# EAGLE design Launch_Tower_Ignition_Board_v6-3 (EAGLE 6.2)
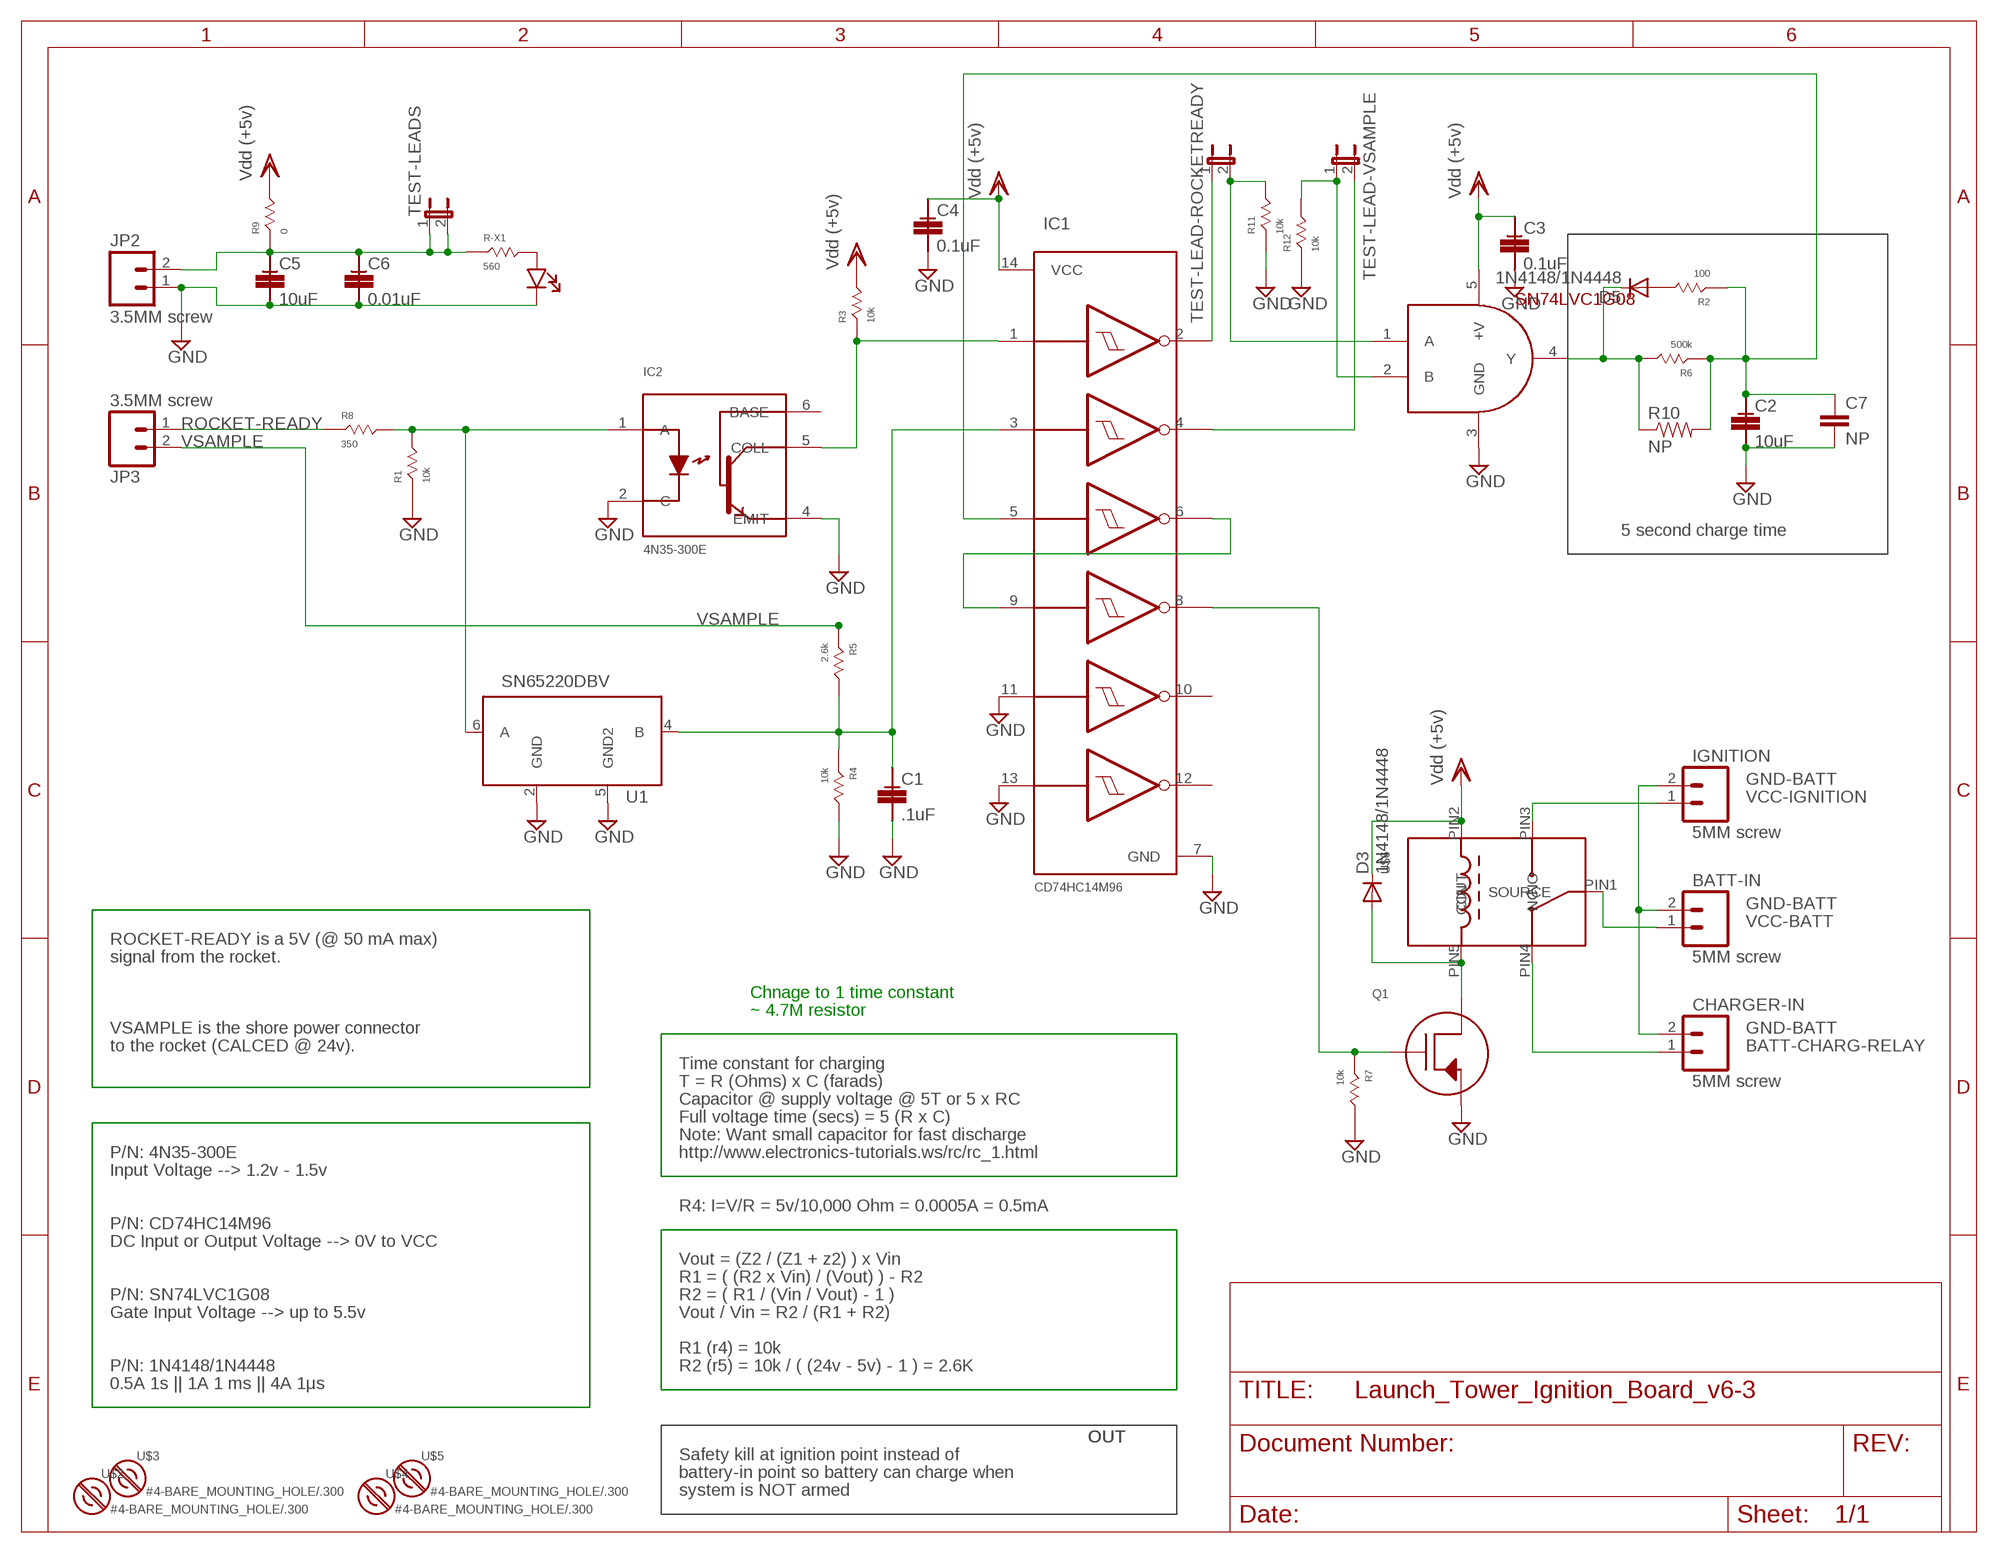
[diagram p0: schematic, sheet 1]

## Parts
BATT-IN  5MM screw  M025MM  [SCREWTERMINAL-5MM-2]
C1  .1uF  CAPACITOR-0805  [0805]
C2  10uF  CAPACITOR-0805  [0805]
C3  0.1uF  CAPACITOR-0805  [0805]
C4  0.1uF  CAPACITOR-0805  [0805]
C5  10uF  CAPACITOR-0805  [0805]
C6  0.01uF  CAPACITOR-0805  [0805]
C7  NP  CAPPTH  [CAP-PTH-SMALL]
CHARGER-IN  5MM screw  M025MM  [SCREWTERMINAL-5MM-2]
D3  1N4148/1N4448  DIODEPTH  [DIODE-1N4001]
D5  1N4148/1N4448  DIODEPTH  [DIODE-1N4001]
IC1  INVERT GATES  HEX_INV_SHMITT_TRIG  [INVERTSOIC14]
IC2  OPTOISOLATOR  [4N35-300E]
IGNITION  5MM screw  M025MM  [SCREWTERMINAL-5MM-2]
JP2  3.5MM screw  M023.5MM  [SCREWTERMINAL-3.5MM-2]
JP3  3.5MM screw  M023.5MM  [SCREWTERMINAL-3.5MM-2]
LED-POWER-INDICATOR  LED-550-XX04  [LED-550]
Q1  NMOSFET  [FETSO-8]
R1  10k  RESISTOR-0805  [0805]
R2  100  RESISTOR-0805  [0805]
R3  10k  RESISTOR-0805  [0805]
R4  10k  RESISTOR-0805  [0805]
R5  2.6k  RESISTOR-0805  [0805]
R6  500k  RESISTOR-0805  [0805]
R7  10k  RESISTOR-0805  [0805]
R8  350  RESISTOR-0805  [0805]
R9  0  RESISTOR-0805  [0805]
R10  NP  RESISTORPTH-1/4W  [AXIAL-0.4]
R11  10k  RESISTOR-0805  [0805]
R12  10k  RESISTOR-0805  [0805]
R-X1  560  RESISTOR-0805  [0805]
TEST-LEAD-ROCKETREADY  JUMPER-2PTH  [1X02]
TEST-LEAD-VSAMPLE  JUMPER-2PTH  [1X02]
TEST-LEADS  JUMPER-2PTH  [1X02]
U1  SN65220DBV  [SOT23-6L]
U$1  AND GATE  SN74LVC1G08  [SOT23-5]
U$2  #4-BARE_MOUNTING_HOLE/.300  [#4/.300-BARE+STD_NUT_OR_STAR_WASHER]
U$3  #4-BARE_MOUNTING_HOLE/.300  [#4/.300-BARE+STD_NUT_OR_STAR_WASHER]
U$4  #4-BARE_MOUNTING_HOLE/.300  [#4/.300-BARE+STD_NUT_OR_STAR_WASHER]
U$5  #4-BARE_MOUNTING_HOLE/.300  [#4/.300-BARE+STD_NUT_OR_STAR_WASHER]
U$6  RELAY-2  [G5LA]

## Nets
BATT-CHARG-RELAY: CHARGER-IN.1 U$6.PIN4(NC)
GND: C1.CATHODE C2.CATHODE C3.CATHODE C4.CATHODE C5.CATHODE C6.CATHODE C7.2 IC1.7(GND) IC1.11(5A) IC1.13(6A) IC2.2(C) IC2.4(EMIT) JP2.1 LED-POWER-INDICATOR.CATHODE Q1.1(SOURCE) R1.ANODE R4.CATHODE R7.CATHODE R11.ANODE R12.ANODE U1.2(GND) U1.5(GND2) U$1.3(GND)
GND-BATT: BATT-IN.2 CHARGER-IN.2 IGNITION.2
N$1: R12.CATHODE TEST-LEAD-VSAMPLE.1 U$1.2(B)
N$2: LED-POWER-INDICATOR.ANODE R-X1.CATHODE
N$3: IC1.1(1A) IC2.5(COLL) R3.ANODE
N$4: JP3.1 R8.ANODE
N$5: R11.CATHODE TEST-LEAD-ROCKETREADY.2 U$1.1(A)
N$6: IC1.4(2Y) TEST-LEAD-VSAMPLE.2
N$7: C1.ANODE IC1.3(2A) R4.ANODE R5.CATHODE U1.4(B)
N$8: D5.A R2.CATHODE
N$9: D3.A Q1.5(DRAIN) U$6.PIN5(CIN)
N$10: IC1.8(4Y) Q1.4(GATE) R7.ANODE
N$11: IC1.2(1Y) TEST-LEAD-ROCKETREADY.1
N$12: C5.ANODE C6.ANODE JP2.2 R9.ANODE R-X1.ANODE TEST-LEADS.1 TEST-LEADS.2
N$13: D5.C R6.CATHODE R10.P$1 U$1.4(Y)
N$15: C2.ANODE C7.1 IC1.5(3A) R2.ANODE R6.ANODE R10.P$2
N-NOT2: IC1.6(3Y) IC1.9(4A)
ROCKET-READY: IC2.1(A) R1.CATHODE R8.CATHODE U1.6(A)
VCC-BATT: BATT-IN.1 U$6.PIN1(SOURCE)
VCC-IGNITION: IGNITION.1 U$6.PIN3(NO)
VDD: C3.ANODE C4.ANODE D3.C IC1.14(VCC) R3.CATHODE R9.CATHODE U$1.5(+V) U$6.PIN2(COUT) ; supply symbol labelled Vdd (+5v)
VSAMPLE: JP3.2 R5.ANODE
Unconnected: IC1.10(5Y) IC1.12(6Y) IC2.6(BASE)

## Notes on the sheet
- 5 second charge time
- ROCKET-READY is a 5V (@ 50 mA max)
- signal from the rocket.
- Chnage to 1 time constant
- ~ 4.7M resistor
- VSAMPLE is the shore power connector
- to the rocket (CALCED @ 24v).
- Time constant for charging
- T = R (Ohms) x C (farads)
- Capacitor @ supply voltage @ 5T or 5 x RC
- Full voltage time (secs) = 5 (R x C)
- Note: Want small capacitor for fast discharge
- P/N: 4N35-300E | http://www.electronics-tutorials.ws/rc/rc_1.html
- Input Voltage --> 1.2v - 1.5v
- R4: I=V/R = 5v/10,000 Ohm = 0.0005A = 0.5mA
- P/N: CD74HC14M96
- DC Input or Output Voltage --> 0V to VCC
- Vout = (Z2 / (Z1 + z2) ) x Vin
- R1 = ( (R2 x Vin) / (Vout) ) - R2
- P/N: SN74LVC1G08 | R2 = ( R1 / (Vin / Vout) - 1 )
- Gate Input Voltage --> up to 5.5v | Vout / Vin = R2 / (R1 + R2)
- R1 (r4) = 10k
- P/N: 1N4148/1N4448 | R2 (r5) = 10k / ( (24v - 5v) - 1 ) = 2.6K
- 0.5A 1s || 1A 1 ms || 4A 1μs
- OUT | OUT | OUT
- Safety kill at ignition point instead of
- battery-in point so battery can charge when
- system is NOT armed

## Library data of the parts
BATT-IN CHARGER-IN IGNITION JP2 JP3 = SparkFun:M02: Header 2 Standard 2-pin 0.1" header. Use with straight break away headers (SKU : PRT-00116), right angle break away headers (PRT-00553), swiss pins (PRT-00743), machine pins (PRT-00117), and female headers (PRT-00115). Molex polarized connector foot print use with SKU : PRT-08233 with associated crimp pins and housings.
C1-C6 = launch-tower:CAPACITOR-0805
C7 = SparkFun:CAP: Capacitor Standard 0603 ceramic capacitor, and 0.1" leaded capacitor.
D3 D5 = SparkFun:DIODE: Diode These are standard reverse protection diodes and small signal diodes. SMA package can handle up to about 1A. SOD-323 can handle about 200mA. What the SOD-323 package when ordering, there are some mfgs out there that are 5-pin packages.
IC1 = launch-tower:HEX_INV_SHMITT_TRIG: Single Schmitt-Trigger Inverter Gate
IC2 = launch-tower:OPTOISOLATOR
LED-POWER-INDICATOR = launch-tower:LED-550-XX04
Q1 = launch-tower:NMOSFET
R1-R9 R11 R12 R-X1 = launch-tower:RESISTOR-0805
R10 = SparkFun:RESISTOR: Resistor Basic schematic elements and footprints for 0603, 1206, and PTH resistors.
TEST-LEAD-ROCKETREADY TEST-LEAD-VSAMPLE TEST-LEADS = SparkFun:JUMPER-2: Jumper Basic 0.1" spaced jumper. Use with breakaway headers.
U1 = sn65220:SN65220
U$1 = SparkFun:SN74LVC1G08
U$2-U$5 = mount:#4-BARE_MOUNTING_HOLE: 1/8" drill hole for #4 screw mount
U$6 = launch-tower:RELAY-2

## Board
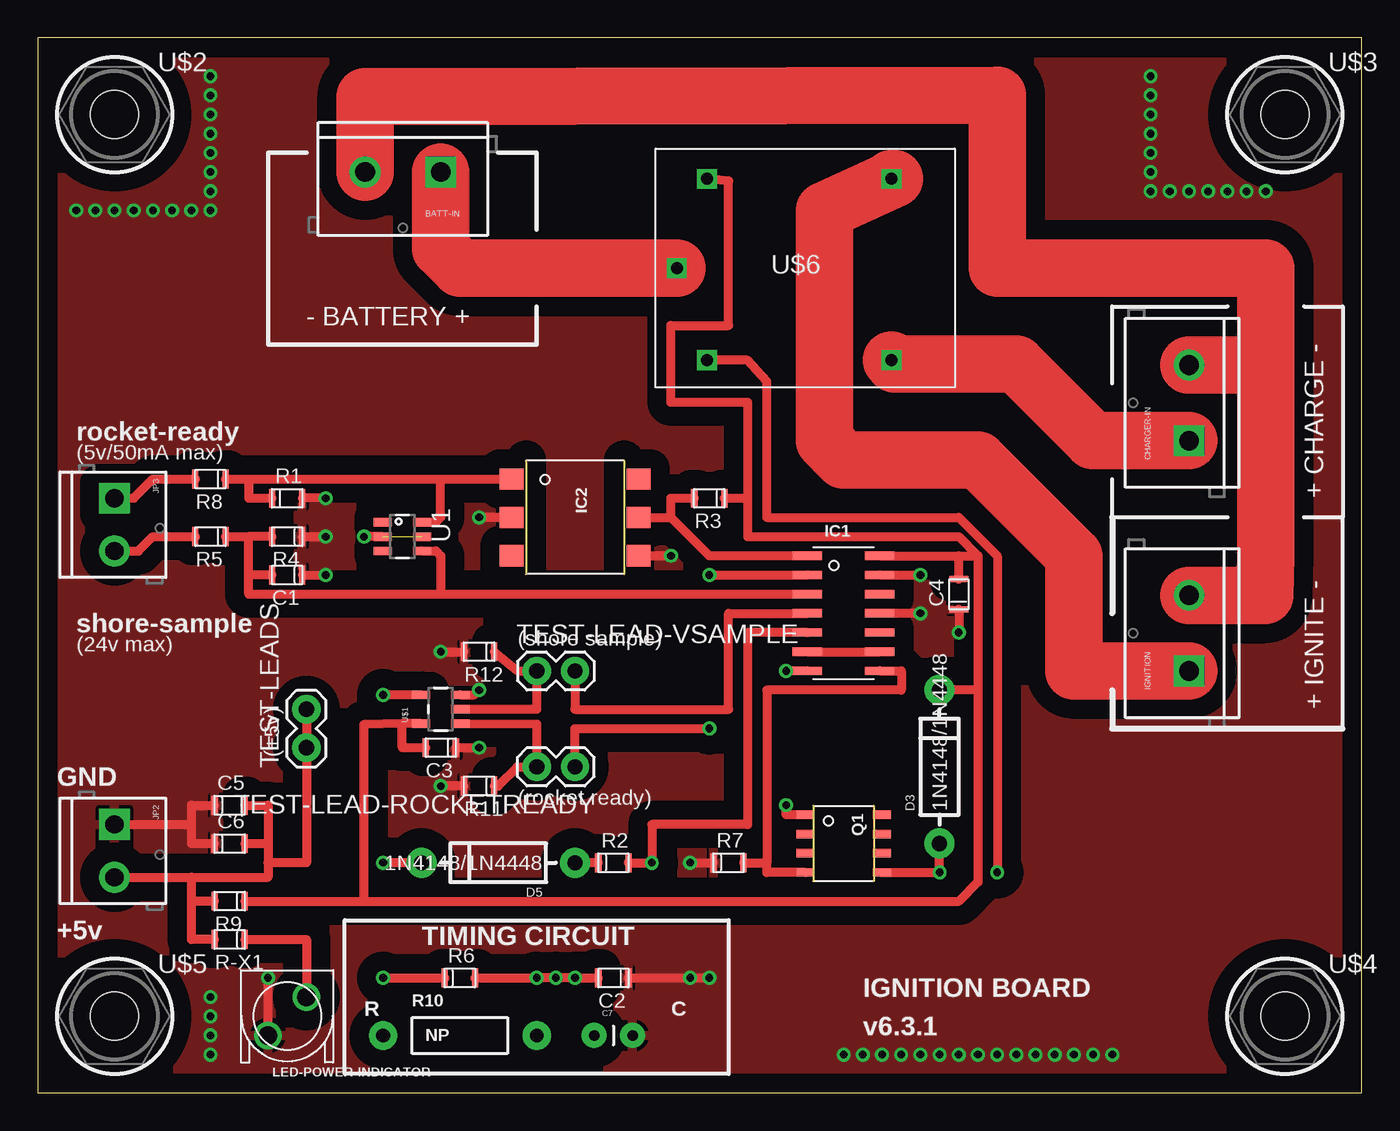
[diagram p1: board, top side]
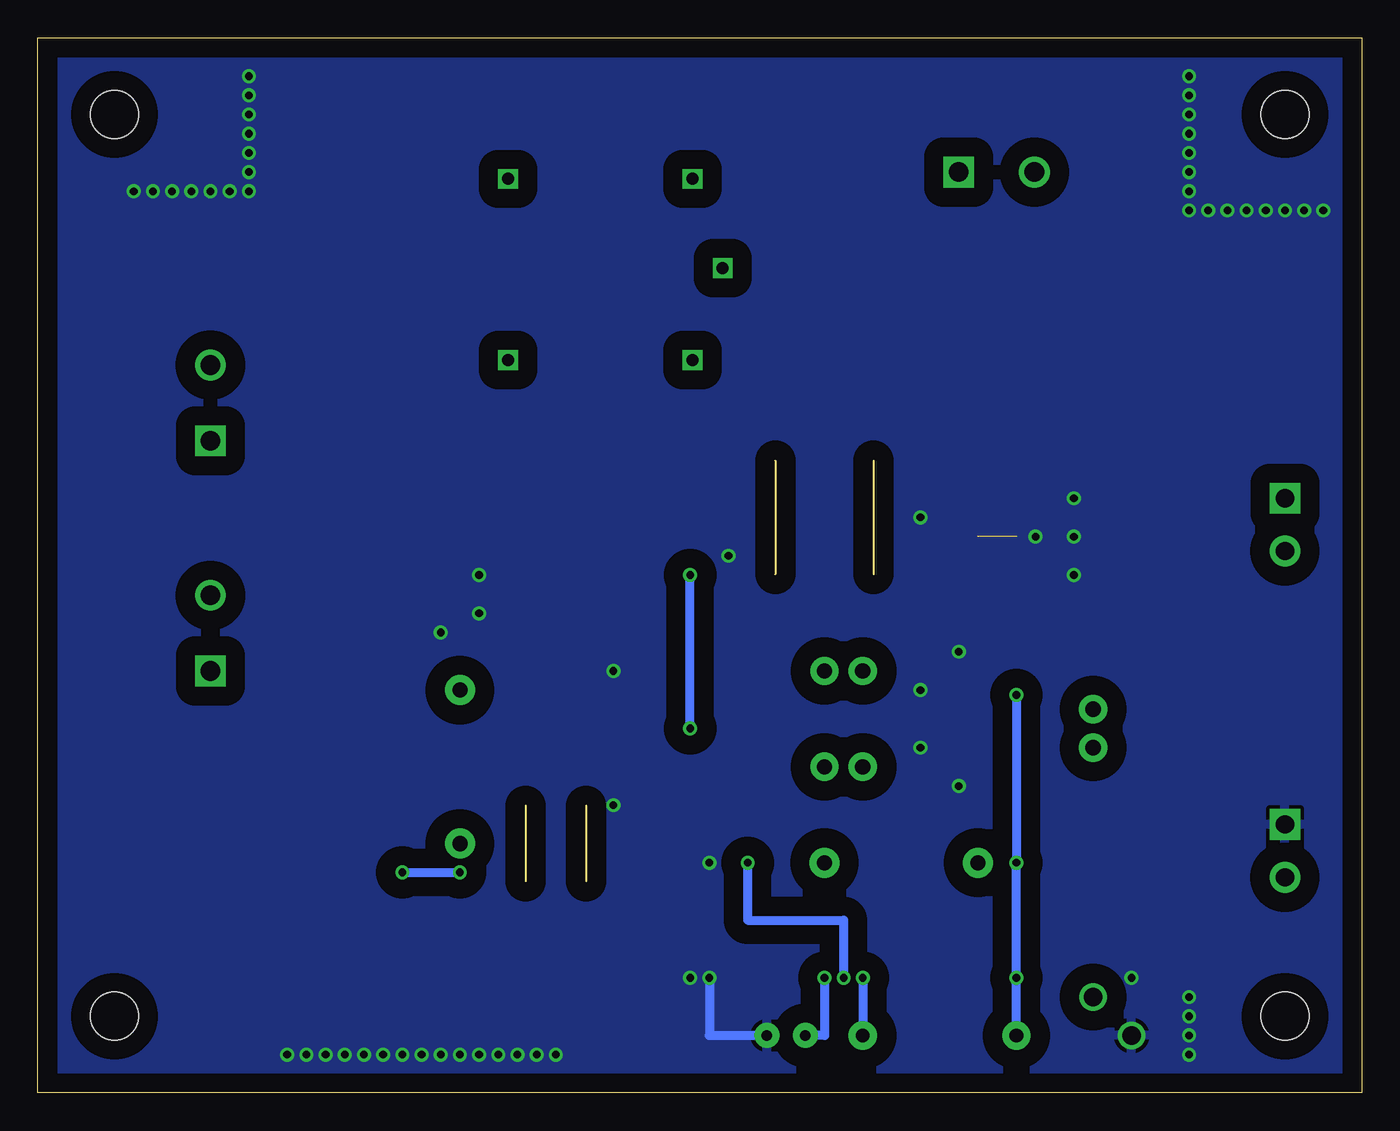
[diagram p2: board, bottom side, seen from below]

Size 87.63 x 69.85 mm. Coordinates in mm from the lower left corner, seen from the top.
Outline: 0,0 87.63,0 87.63,69.85 0,69.85 0,0
Copper layers (1*16): Top 0.035mm / dielectric 1.5mm / Bottom 0.035mm
Design rules: minimum track width 10mil, minimum drill 24mil, track to track 8mil, track to pad 8mil, pad to pad 8mil, via to via 8mil, smd to smd 8mil, copper to edge 40mil, drill to drill 8mil, minimum pad ring 10mil, minimum via ring 8mil, stop-mask expansion 4mil, vias tented up to drill 0mil, thermal gap 10mil

### Footprints (pad centres in the part's own frame; a part is rotated, then mirrored left to right if it is on the bottom)
SCREWTERMINAL-5MM-2 = drill 1.3 pad 2.032 square: 1 0,0 | drill 1.3 pad 2.032: 2 5,0
0805 = smd 0.4 x 1.25: ANODE -1,0; CATHODE 1,0
CAP-PTH-SMALL = drill 0.7 pad 1.651: 1 0,0; 2 2.54,0
DIODE-1N4001 = drill 1 pad 1.981: A -5.08,0; C 5.08,0
INVERTSOIC14 = smd 0.55 x 1.95: 1 -3.81,-2.4; 2 -2.54,-2.4; 3 -1.27,-2.4; 4 0,-2.4; 5 1.27,-2.4; 6 2.54,-2.4; 7 3.81,-2.4; 8 3.81,2.4; 9 2.54,2.4; 10 1.27,2.4; 11 0,2.4; 12 -1.27,2.4; 13 -2.54,2.4; 14 -3.81,2.4
4N35-300E = smd 1.4 x 1.6: 1 -2.54,-4.2; 2 0,-4.2; 3 2.54,-4.2; 4 2.54,4.2; 5 0,4.2; 6 -2.54,4.2
SCREWTERMINAL-3.5MM-2 = drill 1.2 pad 2.032 square: 1 0,0 | drill 1.2 pad 2.032: 2 3.5,0
LED-550 = drill 1.22: ANODE 1.27,1.27; CATHODE -1.27,-1.27
FETSO-8 = smd 0.559 x 1.194: 1 -1.905,-2.527; 2 -0.635,-2.527; 3 0.635,-2.527; 4 1.905,-2.527; 5 1.905,2.527; 6 0.635,2.527; 7 -0.635,2.527; 8 -1.905,2.527
AXIAL-0.4 = drill 0.9 pad 1.88: P$1 -5.08,0; P$2 5.08,0
1X02 = drill 1.016 pad 1.88: 1 0,0; 2 2.54,0
SOT23-6L = smd 0.55 x 1.2: 1 -0.95,-1.3; 2 0,-1.3; 3 0.95,-1.3; 4 0.95,1.3; 5 0,1.3; 6 -0.95,1.3
SOT23-5 = smd 0.55 x 1.2: 1 -0.95,-1.3; 2 0,-1.3; 3 0.95,-1.3; 4 0.95,1.3; 5 -0.95,1.3
#4/.300-BARE+STD_NUT_OR_STAR_WASHER = hole 3.175: 0,0
G5LA = drill 0.8 square: PIN1 -8.5,0; PIN2 -6.5,5.9; PIN3 5.7,5.9; PIN4 5.7,-6.1; PIN5 -6.5,-6.1

### Placement (x,y rotation side)
BATT-IN  26.67,60.96 180 top
C1  16.51,34.29 0 top
C2  38.1,7.62 0 top
C3  26.67,22.86 0 top
C4  60.96,33.02 270 top
C5  12.7,19.05 180 top
C6  12.7,16.51 180 top
C7  36.83,3.81 0 top
CHARGER-IN  76.2,43.18 90 top
D3  59.69,21.59 90 top
D5  30.48,15.24 180 top
IC1  53.34,31.75 270 top
IC2  35.56,38.1 270 top
IGNITION  76.2,27.94 90 top
JP2  5.08,17.78 270 top
JP3  5.08,39.37 270 top
LED-POWER-INDICATOR  16.51,5.08 0 top
Q1  53.34,16.51 270 top
R1  16.51,39.37 180 top
R2  38.1,15.24 180 top
R3  44.45,39.37 0 top
R4  16.51,36.83 0 top
R5  11.43,36.83 0 top
R6  27.94,7.62 180 top
R7  45.72,15.24 180 top
R8  11.43,40.64 0 top
R9  12.7,12.7 0 top
R10  27.94,3.81 0 top
R11  29.21,20.32 0 top
R12  29.21,29.21 0 top
R-X1  12.7,10.16 0 top
TEST-LEAD-ROCKETREADY  35.56,21.59 180 top
TEST-LEAD-VSAMPLE  33.02,27.94 0 top
TEST-LEADS  17.78,22.86 90 top
U1  24.13,36.83 270 top
U$1  26.67,25.4 90 top
U$2  5.08,64.77 0 top
U$3  82.55,64.77 0 top
U$4  82.55,5.08 0 top
U$5  5.08,5.08 0 top
U$6  50.8,54.61 0 top

### Tracks (layer width: path | path; a pad name or v marks a point on that pad's centre or on a via)
BATT-CHARG-RELAY
  Top 3.81: CHARGER-IN.1 69.85,43.18 64.77,48.26 56.75,48.26 U$6.PIN4
GND  (via drill 0.51)  (1 unrouted)
  Top 0.61: IC1.7 v49.53,27.94 | Q1.1 49.53,18.41 v49.53,19.05 | v41.91,35.56 IC2.4 | IC2.2 v29.21,38.1 | U1.2 v21.59,36.83 | U$1.3 28.89,26.35 v29.21,26.67 | v58.42,31.75 IC1.11 | IC1.13 v58.42,34.29 | 10.16,17.78 10.16,19.05 C5.CATHODE | 10.16,17.78 10.16,16.51 C6.CATHODE | JP2.1 10.16,17.78 | LED-POWER-INDICATOR.CATHODE v15.24,7.62 | v19.05,39.37 R1.ANODE | R4.CATHODE v19.05,36.83 | v43.18,15.24 R7.CATHODE | v26.67,29.21 R12.ANODE | R11.ANODE v26.67,20.32 | v44.45,7.62 v43.18,7.62 C2.CATHODE | C3.CATHODE v29.21,22.86 | C4.CATHODE v60.96,30.48 | C1.CATHODE v19.05,34.29
  Bottom 0.61: v43.18,7.62 43.18,3.81 C7.2
  other vias: 69.85,2.54 68.58,2.54 67.31,2.54 66.04,2.54 64.77,2.54 63.5,2.54 62.23,2.54 60.96,2.54 59.69,2.54 58.42,2.54 57.15,2.54 55.88,2.54 54.61,2.54 53.34,2.54 73.66,67.31 73.66,66.04 73.66,64.77 73.66,63.5 73.66,62.23 73.66,60.96 73.66,59.69 74.93,59.69 76.2,59.69 77.47,59.69 78.74,59.69 80.01,59.69 81.28,59.69 11.43,67.31 11.43,66.04 11.43,64.77 11.43,63.5 11.43,62.23 11.43,60.96 11.43,59.69 11.43,58.42 10.16,58.42 8.89,58.42 7.62,58.42 6.35,58.42 5.08,58.42 3.81,58.42 2.54,58.42 11.43,2.54 11.43,3.81 11.43,5.08 11.43,6.35 71.12,2.54
  pour Top (isolate 1.27): 1.27,68.58 86.36,68.58 86.36,1.27 1.27,1.27
  pour Bottom (isolate 1.27): 1.27,68.58 86.36,68.58 86.36,1.27 1.27,1.27
GND-BATT
  Top 3.81: BATT-IN.2 21.67,65.96 63.5,66.04 63.5,54.61 81.28,54.61 81.28,48.26 | 81.28,48.26 81.28,35.56 81.2,32.94 IGNITION.2 | CHARGER-IN.2 81.2,48.18 81.28,48.26
N$1
  Top 0.61: U$1.2 33.02,25.4 TEST-LEAD-VSAMPLE.1 31.75,27.94 R12.CATHODE
N$2
  Top 0.61: R-X1.CATHODE 17.78,10.16 LED-POWER-INDICATOR.ANODE
N$3
  Top 0.61: IC2.5 41.91,38.1 | IC1.1 44.45,35.56 43.18,36.83 41.91,38.1 | 41.91,38.1 41.91,39.37 R3.ANODE
N$4
  Top 0.61: JP3.1 6.35,39.37 7.62,40.64 R8.ANODE
N$5
  Top 0.61: U$1.1 33.02,24.43 33.02,24.42 33.02,22.86 TEST-LEAD-ROCKETREADY.2 31.75,21.59 30.48,20.32 R11.CATHODE
N$6
  Top 0.61: IC1.4 45.72,31.75 45.72,25.4 35.56,25.4 TEST-LEAD-VSAMPLE.2
N$7
  Top 0.61: 13.97,34.29 13.97,33.02 26.67,33.02 | 13.97,34.29 13.97,36.83 | 26.67,33.02 IC1.3 | U1.4 26.35,35.88 26.67,35.56 26.67,33.02 | R5.CATHODE 13.97,36.83 | R4.ANODE 13.97,36.83 | C1.ANODE 13.97,34.29
N$8
  Top 0.61: R2.CATHODE D5.A
N$9  (via drill 0.51)
  Top 0.61: Q1.5 v59.69,14.61 D3.A | U$6.PIN5 46.99,48.51 48.26,47.09 48.26,38.1 60.96,38.1 63.5,35.56 v63.5,14.61
  Bottom 0.61: v63.5,14.61 v59.69,14.61
N$10
  Top 0.61: IC1.8 57.15,27.94 57.15,26.67 48.26,26.67 48.26,15.24 | Q1.4 48.26,14.61 48.26,15.24 | R7.ANODE 48.26,15.24
N$11  (via drill 0.51)
  Top 0.61: v44.45,24.13 35.56,24.13 TEST-LEAD-ROCKETREADY.1 | v44.45,34.29 IC1.2
  Bottom 0.61: v44.45,24.13 v44.45,34.29
N$12
  Top 0.61: 15.24,16.51 15.24,19.05 C5.ANODE | 15.24,16.51 15.24,15.24 | JP2.2 10.16,14.28 | 10.16,14.28 15.24,14.28 15.24,15.24 | 10.16,14.28 10.16,12.7 | 10.16,12.7 10.16,10.16 R-X1.ANODE | 15.24,15.24 17.78,15.24 TEST-LEADS.1 TEST-LEADS.2 | R9.ANODE 10.16,12.7 | C6.ANODE 15.24,16.51
N$13  (via drill 0.51)
  Top 0.61: D5.C v22.86,15.24 | U$1.4 v22.86,26.35 | v22.86,7.62 R6.CATHODE
  Bottom 0.61: v22.86,26.35 v22.86,15.24 v22.86,7.62 R10.P$1
N$15  (via drill 0.51)
  Top 0.61: IC1.5 46.99,30.48 46.99,17.78 40.64,17.78 v40.64,15.24 R2.ANODE | R6.ANODE v33.02,7.62 v34.29,7.62 v35.56,7.62 C2.ANODE
  Bottom 0.61: v35.56,7.62 35.56,3.81 C7.1 | v33.02,7.62 R10.P$2 | v40.64,15.24 40.64,11.43 34.29,11.43 v34.29,7.62
N-NOT2
  Top 0.61: IC1.6 IC1.9
ROCKET-READY
  Top 0.61: 13.97,40.64 26.67,40.64 | 26.67,40.64 IC2.1 | U1.6 26.35,37.78 26.67,38.1 26.67,40.64 | R8.CATHODE 13.97,40.64 | 13.97,40.64 13.97,39.37 R1.CATHODE
VCC-BATT
  Top 3.81: BATT-IN.1 26.67,55.88 27.94,54.61 U$6.PIN1
VCC-IGNITION
  Top 3.81: U$6.PIN3 56.7,60.51 52.07,58.42 52.07,43.18 53.34,41.91 62.23,41.91 68.58,35.56 68.58,27.94 IGNITION.1
VDD
  Top 0.61: 62.23,35.56 62.23,26.67 | 62.23,26.67 62.23,13.97 60.96,12.7 21.59,12.7 | 62.23,26.67 D3.C | 21.59,12.7 21.59,24.38 24.13,24.45 | U$1.5 24.13,24.45 | 24.13,24.45 24.13,22.86 C3.ANODE | IC1.14 60.96,35.56 | 60.96,35.56 62.23,35.56 | U$6.PIN2 45.72,60.36 45.72,50.8 41.91,50.8 41.91,45.72 46.99,45.72 46.99,39.37 | 62.23,35.56 60.96,36.83 46.99,36.83 46.99,39.37 | R3.CATHODE 46.99,39.37 | R9.CATHODE 21.59,12.7 | C4.ANODE 60.96,35.56
VSAMPLE
  Top 0.61: JP3.2 6.66,35.87 7.62,36.83 R5.ANODE

### Text on the board
tPlace: - BATTERY + | rocket-ready | (5v/50mA max) | + CHARGE - | shore-sample | (shore sample) | (24v max) | + IGNITE - | (+5v) | GND | (rocket ready) | +5v | TIMING CIRCUIT | IGNITION BOARD | R | C | v6.3.1